# EAGLE schematic Schematics (EAGLE 6.0)
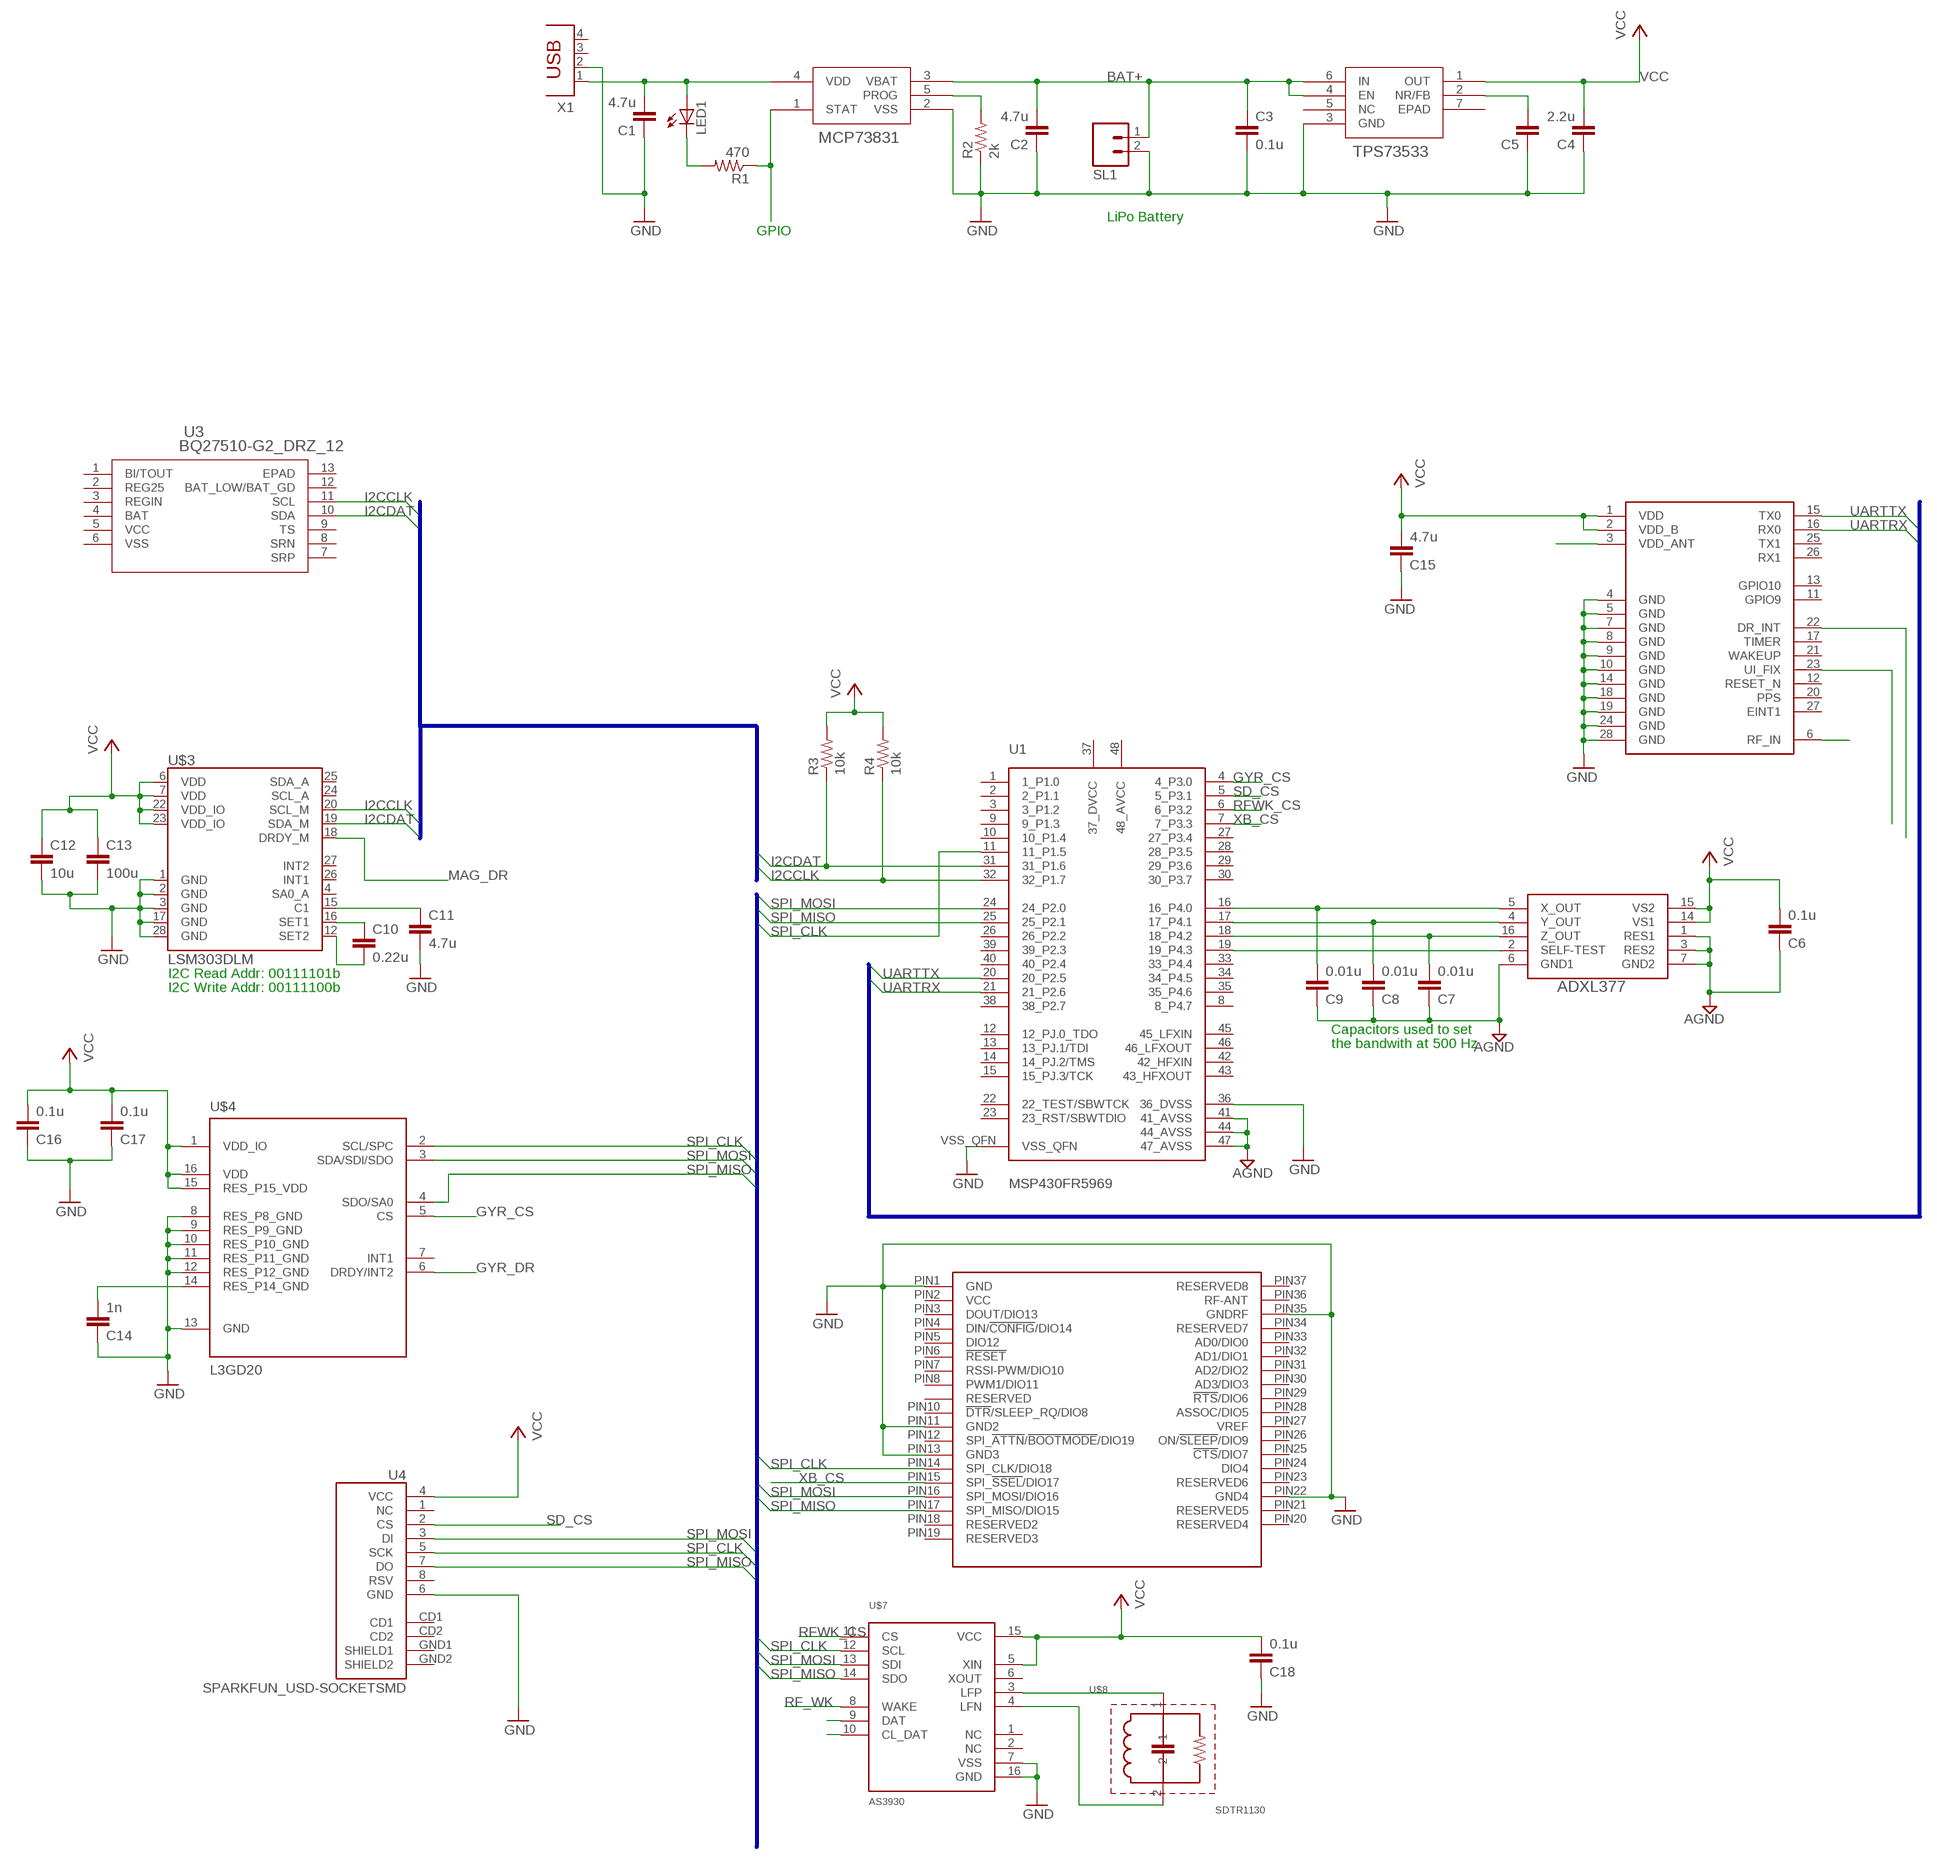
[diagram p0: schematic, sheet 1]

## Parts
C1  4.7u  C-EU025-025X050  [C025-025X050]
C2  4.7u  C-EU025-025X050  [C025-025X050]
C3  0.1u  C-EU025-024X044  [C025-024X044]
C4  2.2u  C-EU025-025X050  [C025-025X050]
C5  C-EU025-025X050  [C025-025X050]
C6  0.1u  C-EU025-025X050  [C025-025X050]
C7  0.01u  C-EU025-025X050  [C025-025X050]
C8  0.01u  C-EU025-025X050  [C025-025X050]
C9  0.01u  C-EU025-025X050  [C025-025X050]
C10  0.22u  C-EU025-024X044  [C025-024X044]
C11  4.7u  C-EU025-024X044  [C025-024X044]
C12  10u  C-EU025-024X044  [C025-024X044]
C13  100u  C-EU025-024X044  [C025-024X044]
C14  1n  C-EU025-025X050  [C025-025X050]
C15  4.7u  C-EU025-025X050  [C025-025X050]
C16  0.1u  C-EU025-025X050  [C025-025X050]
C17  0.1u  C-EU025-025X050  [C025-025X050]
C18  0.1u  C-EU025-025X050  [C025-025X050]
LED1  LED  [SMARTLED-TTW]
R1  470  R-US_0204/2V  [0204V]
R2  2k  R-US_0204/2V  [0204V]
R3  10k  R-US_0204/2V  [0204V]
R4  10k  R-US_0204/2V  [0204V]
SL1  M02  [02P]
U1  MSP430FR5969  [RGZ(S-PQFP-N48)]
U2  TPS73533_DRV_6  [DRV6_1P6X1]
U3  BQ27510-G2_DRZ_12  [DRZ12_1P95X2P45]
U4  SPARKFUN_USD-SOCKETSMD  [SPARKFUN_MICRO-SD-SOCKET-PP]
U$1  MCP73831-XXXX/OT  [SOT-23-5_MC]
U$2  ADXL377  [LFCSP-16]
U$3  LSM303DLM  [LGA28-5X5]
U$4  L3GD20  [L3GD20]
U$5  QUBIQ_XBEE-SMT  [QUBIQ_FLAT-RF]
U$6  IT530  [IT530]
U$7  AS3930  [AS3930]
U$8  SDTR1130  [SDTR1130-SMD]
X1  PN61729  [PN61729]

## Nets
AGND: C6.1 C7.1 C8.1 C9.1 U1.41(41_AVSS) U1.44(44_AVSS) U1.47(47_AVSS) U$2.1(RES1) U$2.3(RES2) U$2.6(GND1) U$2.7(GND2)
BAT+: C2.2 C3.1 SL1.1 U2.4(EN) U2.6(IN) U$1.3(VBAT)
GND: C1.1 C2.1 C3.2 C4.1 C5.1 C11.2 C12.2 C13.2 C14.1 C15.1 C16.1 C17.1 C18.1 R2.1 SL1.2 U1.36(36_DVSS) U1.VSS_QFN U2.3(GND) U4.6(GND) U$1.2(VSS) U$3.1(GND) U$3.2(GND) U$3.3(GND) U$3.17(GND) U$3.28(GND) U$4.8(RES_P8_GND) U$4.9(RES_P9_GND) U$4.10(RES_P10_GND) U$4.11(RES_P11_GND) U$4.12(RES_P12_GND) U$4.13(GND) U$5.PIN1(GND) U$5.PIN11(GND2) U$5.PIN13(GND3) U$5.PIN22(GND4) U$5.PIN35(GNDRF) U$6.4(GND) U$6.5(GND) U$6.7(GND) U$6.8(GND) U$6.9(GND) U$6.10(GND) U$6.14(GND) U$6.18(GND) U$6.19(GND) U$6.24(GND) U$6.28(GND) U$7.7(VSS) U$7.16(GND) X1.2
GYR_CS: U1.4(4_P3.0) U$4.5(CS)
GYR_DR: U$4.6(DRDY/INT2)
I2CCLK: R4.1 U1.32(32_P1.7) U3.11(SCL) U$3.20(SCL_M)
I2CDAT: R3.1 U1.31(31_P1.6) U3.10(SDA) U$3.19(SDA_M)
MAG_DR: U$3.18(DRDY_M)
N$1: C1.2 LED1.A@1(A) U$1.4(VDD) X1.1
N$2: LED1.C@1(C) R1.2
N$3: R1.1 U$1.1(STAT)
N$4: R2.2 U$1.5(PROG)
N$5: U1.19(19_P4.3) U$2.2(SELF-TEST)
N$6: U$7.9(DAT)
N$7: C5.2 U2.2(NR/FB)
N$8: C14.2 U$4.14(RES_P14_GND)
N$9: C10.1 U$3.16(SET1)
N$10: C10.2 U$3.12(SET2)
N$11: C11.1 U$3.15(C1)
N$12: U$7.4(LFN) U$8.2
N$13: U$7.10(CL_DAT)
N$14: U$6.6(RF_IN)
N$15: U$7.3(LFP) U$8.1
N$16: U$6.3(VDD_ANT)
N$17: U$6.22(DR_INT)
N$18: C9.2 U1.16(16_P4.0) U$2.5(X_OUT)
N$19: U$6.23(UI_FIX)
N$20: C8.2 U1.17(17_P4.1) U$2.4(Y_OUT)
N$21: C7.2 U1.18(18_P4.2) U$2.16(Z_OUT)
RF_WK: U$7.8(WAKE)
RFWK_CS: U1.6(6_P3.2) U$7.11(CS)
SD_CS: U1.5(5_P3.1) U4.2(CS)
SPI_CLK: U1.11(11_P1.5) U4.5(SCK) U$4.2(SCL/SPC) U$5.PIN14(SPI_CLK/DIO18) U$7.12(SCL)
SPI_MISO: U1.25(25_P2.1) U4.7(DO) U$4.4(SDO/SA0) U$5.PIN17(SPI_MISO/DIO15) U$7.14(SDO)
SPI_MOSI: U1.24(24_P2.0) U4.3(DI) U$4.3(SDA/SDI/SDO) U$5.PIN16(SPI_MOSI/DIO16) U$7.13(SDI)
UARTRX: U1.21(21_P2.6) U$6.16(RX0)
UARTTX: U1.20(20_P2.5) U$6.15(TX0)
VCC: C4.2 C6.2 C12.1 C13.1 C15.2 C16.2 C17.2 C18.2 R3.2 R4.2 U2.1(OUT) U4.4(VCC) U$2.14(VS1) U$2.15(VS2) U$3.6(VDD) U$3.7(VDD) U$3.22(VDD_IO) U$3.23(VDD_IO) U$4.1(VDD_IO) U$4.15(RES_P15_VDD) U$4.16(VDD) U$6.1(VDD) U$6.2(VDD_B) U$7.5(XIN) U$7.15(VCC)
XB_CS: U1.7(7_P3.3) U$5.PIN15(SPI_!SSEL!/DIO17)
Unconnected: U1.1(1_P1.0) U1.2(2_P1.1) U1.3(3_P1.2) U1.8(8_P4.7) U1.9(9_P1.3) U1.10(10_P1.4) U1.12(12_PJ.0_TDO) U1.13(13_PJ.1/TDI) U1.14(14_PJ.2/TMS) U1.15(15_PJ.3/TCK) U1.22(22_TEST/SBWTCK) U1.23(23_RST/SBWTDIO) U1.26(26_P2.2) U1.27(27_P3.4) U1.28(28_P3.5) U1.29(29_P3.6) U1.30(30_P3.7) U1.33(33_P4.4) U1.34(34_P4.5) U1.35(35_P4.6) U1.37(37_DVCC) U1.38(38_P2.7) U1.39(39_P2.3) U1.40(40_P2.4) U1.42(42_HFXIN) U1.43(43_HFXOUT) U1.45(45_LFXIN) U1.46(46_LFXOUT) U1.48(48_AVCC) U2.5(NC) U2.7(EPAD) U3.1(BI/TOUT) U3.4(BAT) U3.7(SRP) U3.8(SRN) U3.9(TS) U3.12(BAT_LOW/BAT_GD) U4.1(NC) U4.8(RSV) U4.CD1 U4.CD2 U4.GND1(SHIELD1) U4.GND2(SHIELD2) U$3.4(SA0_A) U$3.24(SCL_A) U$3.25(SDA_A) U$3.26(INT1) U$3.27(INT2) U$4.7(INT1) U$5.PIN2(VCC) U$5.PIN3(DOUT/DIO13) U$5.PIN4(DIN/!CONFIG!/DIO14) U$5.PIN5(DIO12) U$5.PIN6(!RESET) U$5.PIN7(RSSI-PWM/DIO10) U$5.PIN8(PWM1/DIO11) U$5.PIN9(RESERVED) U$5.PIN10(!DTR!/SLEEP_RQ/DIO8) U$5.PIN12(SPI_!ATTN!/!BOOTMODE!/DIO19) U$5.PIN18(RESERVED2) U$5.PIN19(RESERVED3) U$5.PIN20(RESERVED4) U$5.PIN21(RESERVED5) U$5.PIN23(RESERVED6) U$5.PIN24(DIO4) U$5.PIN25(!CTS!/DIO7) U$5.PIN26(ON/!SLEEP!/DIO9) U$5.PIN27(VREF) U$5.PIN28(ASSOC/DIO5) U$5.PIN29(!RTS!/DIO6) U$5.PIN30(AD3/DIO3) U$5.PIN31(AD2/DIO2) U$5.PIN32(AD1/DIO1) U$5.PIN33(AD0/DIO0) U$5.PIN34(RESERVED7) U$5.PIN36(RF-ANT) U$5.PIN37(RESERVED8) U$6.11(GPIO9) U$6.12(RESET_N) U$6.13(GPIO10) U$6.17(TIMER) U$6.20(PPS) U$6.21(WAKEUP) U$6.25(TX1) U$6.26(RX1) U$6.27(EINT1) U$7.1(NC) U$7.2(NC) U$7.6(XOUT) X1.3 X1.4

## Buses
I2CDAT,I2CCLK
SPI_CLK,SPI_MOSI,SPI_MISO
UARTTX,UARTRX

## Notes on the sheet
- LiPo Battery
- GPIO
- I2C Read Addr: 00111101b
- I2C Write Addr: 00111100b
- Capacitors used to set
- the bandwith at 500 Hz

## Power pins joined to a net without a drawn wire
EPAD: U3.13(EPAD)
REG25: U3.2(REG25)
REGIN: U3.3(REGIN)
VCC: U3.5(VCC)
VSS: U3.6(VSS)

## Library data of the parts
C1-C18 = rcl:C-EU: CAPACITOR, European symbol
LED1 = led:LED: LED OSRAM: - CHIPLED LG R971, LG N971, LY N971, LG Q971, LY Q971, LO R971, LY R971 LH N974, LH R974 LS Q976, LO Q976, LY Q976 LO Q996 - Hyper CHIPLED LW Q18S LB Q993, LB Q99A, LB R99A - SideLED LS A670, LO A670, LY A670, LG A670, LP A670 LB A673, LV A673, LT A673, LW A673 LH A674 LY A675 LS A676, LA A676, LO A676, LY A676, LW A676 LS A679, LY A679, LG A679 - Hyper Micro SIDELED® LS Y876, LA Y876, LO Y876, LY Y876 LT Y87S - SmartLED LW L88C, LW L88S LB L89C, LB L89S, LG L890 LS L89K, LO L89K, LY L89K LS L896, LA L896, LO L896, LY L896 - TOPLED LS T670, LO T670, LY T670, LG T670, LP T670 LSG T670, LSP T670, LSY T670, LOP T670, LYG T670 LG T671, LOG T671, LSG T671 LB T673, LV T673, LT T673, LW T673 LH T674 LS T676, LA T676, LO T676, LY T676, LB T676, LH T676, LSB T676, LW T676 LB T67C, LV T67C, LT T67C, LS T67K, LO T67K, LY T67K, LW E67C LS E67B, LA E67B, LO E67B, LY E67B, LB E67C, LV E67C, LT E67C LW T67C LS T679, LY T679, LG T679 LS T770, LO T770, LY T770, LG T770, LP T770 LB T773, LV T773, LT T773, LW T773 LH T774 LS E675, LA E675, LY E675, LS T675 LS T776, LA T776, LO T776, LY T776, LB T776 LHGB T686 LT T68C, LB T68C - Hyper Mini TOPLED® LB M676 - Mini TOPLED Santana® LG M470 LS M47K, LO M47K, LY M47K Source: http://www.osram.convergy.de LUXEON: - LUMILED® LXK2-PW12-R00, LXK2-PW12-S00, LXK2-PW14-U00, LXK2-PW14-V00 LXK2-PM12-R00, LXK2-PM12-S00, LXK2-PM14-U00 LXK2-PE12-Q00, LXK2-PE12-R00, LXK2-PE12-S00, LXK2-PE14-T00, LXK2-PE14-U00 LXK2-PB12-K00, LXK2-PB12-L00, LXK2-PB12-M00, LXK2-PB14-N00, LXK2-PB14-P00, LXK2-PB14-Q00 LXK2-PR12-L00, LXK2-PR12-M00, LXK2-PR14-Q00, LXK2-PR14-R00 LXK2-PD12-Q00, LXK2-PD12-R00, LXK2-PD12-S00 LXK2-PH12-R00, LXK2-PH12-S00 LXK2-PL12-P00, LXK2-PL12-Q00, LXK2-PL12-R00 Source: www.luxeon.com KINGBRIGHT: KA-3528ASYC Source: www.kingbright.com
R1-R4 = rcl:R-US_: RESISTOR, American symbol
SL1 = con-amp-quick:M02: AMP QUICK CONNECTOR; OC_FARNELL: unknown; OC_NEWARK: unknown
U1 = hijack:MSP430FR5969
U2 = TPS73533:TPS73533_DRV_6
U3 = Micro2:BQ27510-G2_DRZ_12; DATASHEETURL: http://www.ti.com/lit/gpn/BQ27510-G2; DESCRIPTION: System-Side Impedance-Track Fuel Gauge With Direct Battery Connection; FAMILY_NAME: BATTERY FUEL GAUGE; GENERIC_PART_NUMBER: BQ27510-G2; INDUSTRY_STD_PKG_TYPE: SON; MANUFACTURER: Texas Instruments; PACKAGE_DESIGNATOR: DRZ; PIN_COUNT: 12
U4 = Micro2:SPARKFUN_USD-SOCKET: microSD Socket Push-push type uSD socket. Schematic element and footprint production proven. Spark Fun Electronics SKU : PRT-00127. tDoc lines correctly indicate media card edge positions when inserting (unlocked, locked, depressed).
U$1 = MCP73831:MCP73831-XXXX/OT
U$2 = Micro2:ADXL377
U$3 = Micro2:LSM303DLM: Sensor module: 3-axis accelerometer and 3-axis magnetometer
U$4 = Micro2:L3GD20: L3GD20
U$5 = Micro2:QUBIQ_XBEE-SMT
U$6 = Micro2:IT530: IT530 Datasheet <http://www.u-blox.com/images/downloads/Product_Docs/IT530_DataSheet_%28FTX-HW-12008%29.pdf>
U$7 = Micro2:AS3930: AS3930
U$8 = Micro2:SDTR1130
X1 = con-berg:PN61729: BERG USB connector; OC_FARNELL: unknown; OC_NEWARK: unknown